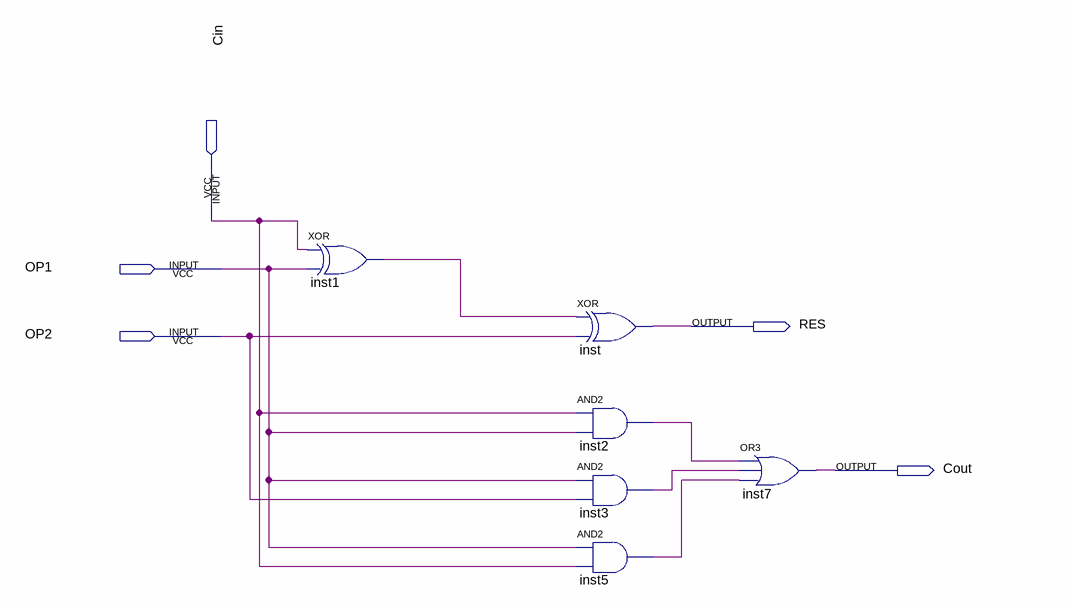
[diagram p0: schematic sheet]
// Quartus schematic adder.bdf as structural Verilog: 6 symbols, 5 pins
module adder (
  input  Cin,
  input  OP1,
  input  OP2,
  output RES,
  output Cout
);

  wire inst1_out, inst2_out, inst3_out, inst5_out;

  xor inst1 (inst1_out, Cin, OP1);
  xor inst (RES, inst1_out, OP2);
  and inst2 (inst2_out, Cin, OP1);
  and inst3 (inst3_out, OP1, OP2);
  and inst5 (inst5_out, OP1, Cin);
  or inst7 (Cout, inst2_out, inst3_out, inst5_out);
endmodule
